# EasyEDA schematic schematics.json
TITLE: Broca; REV: A; Date: 2024-07-22; Sheet: 1/1; Drawn By: Arthur LAURENT; Company: Mental Noise
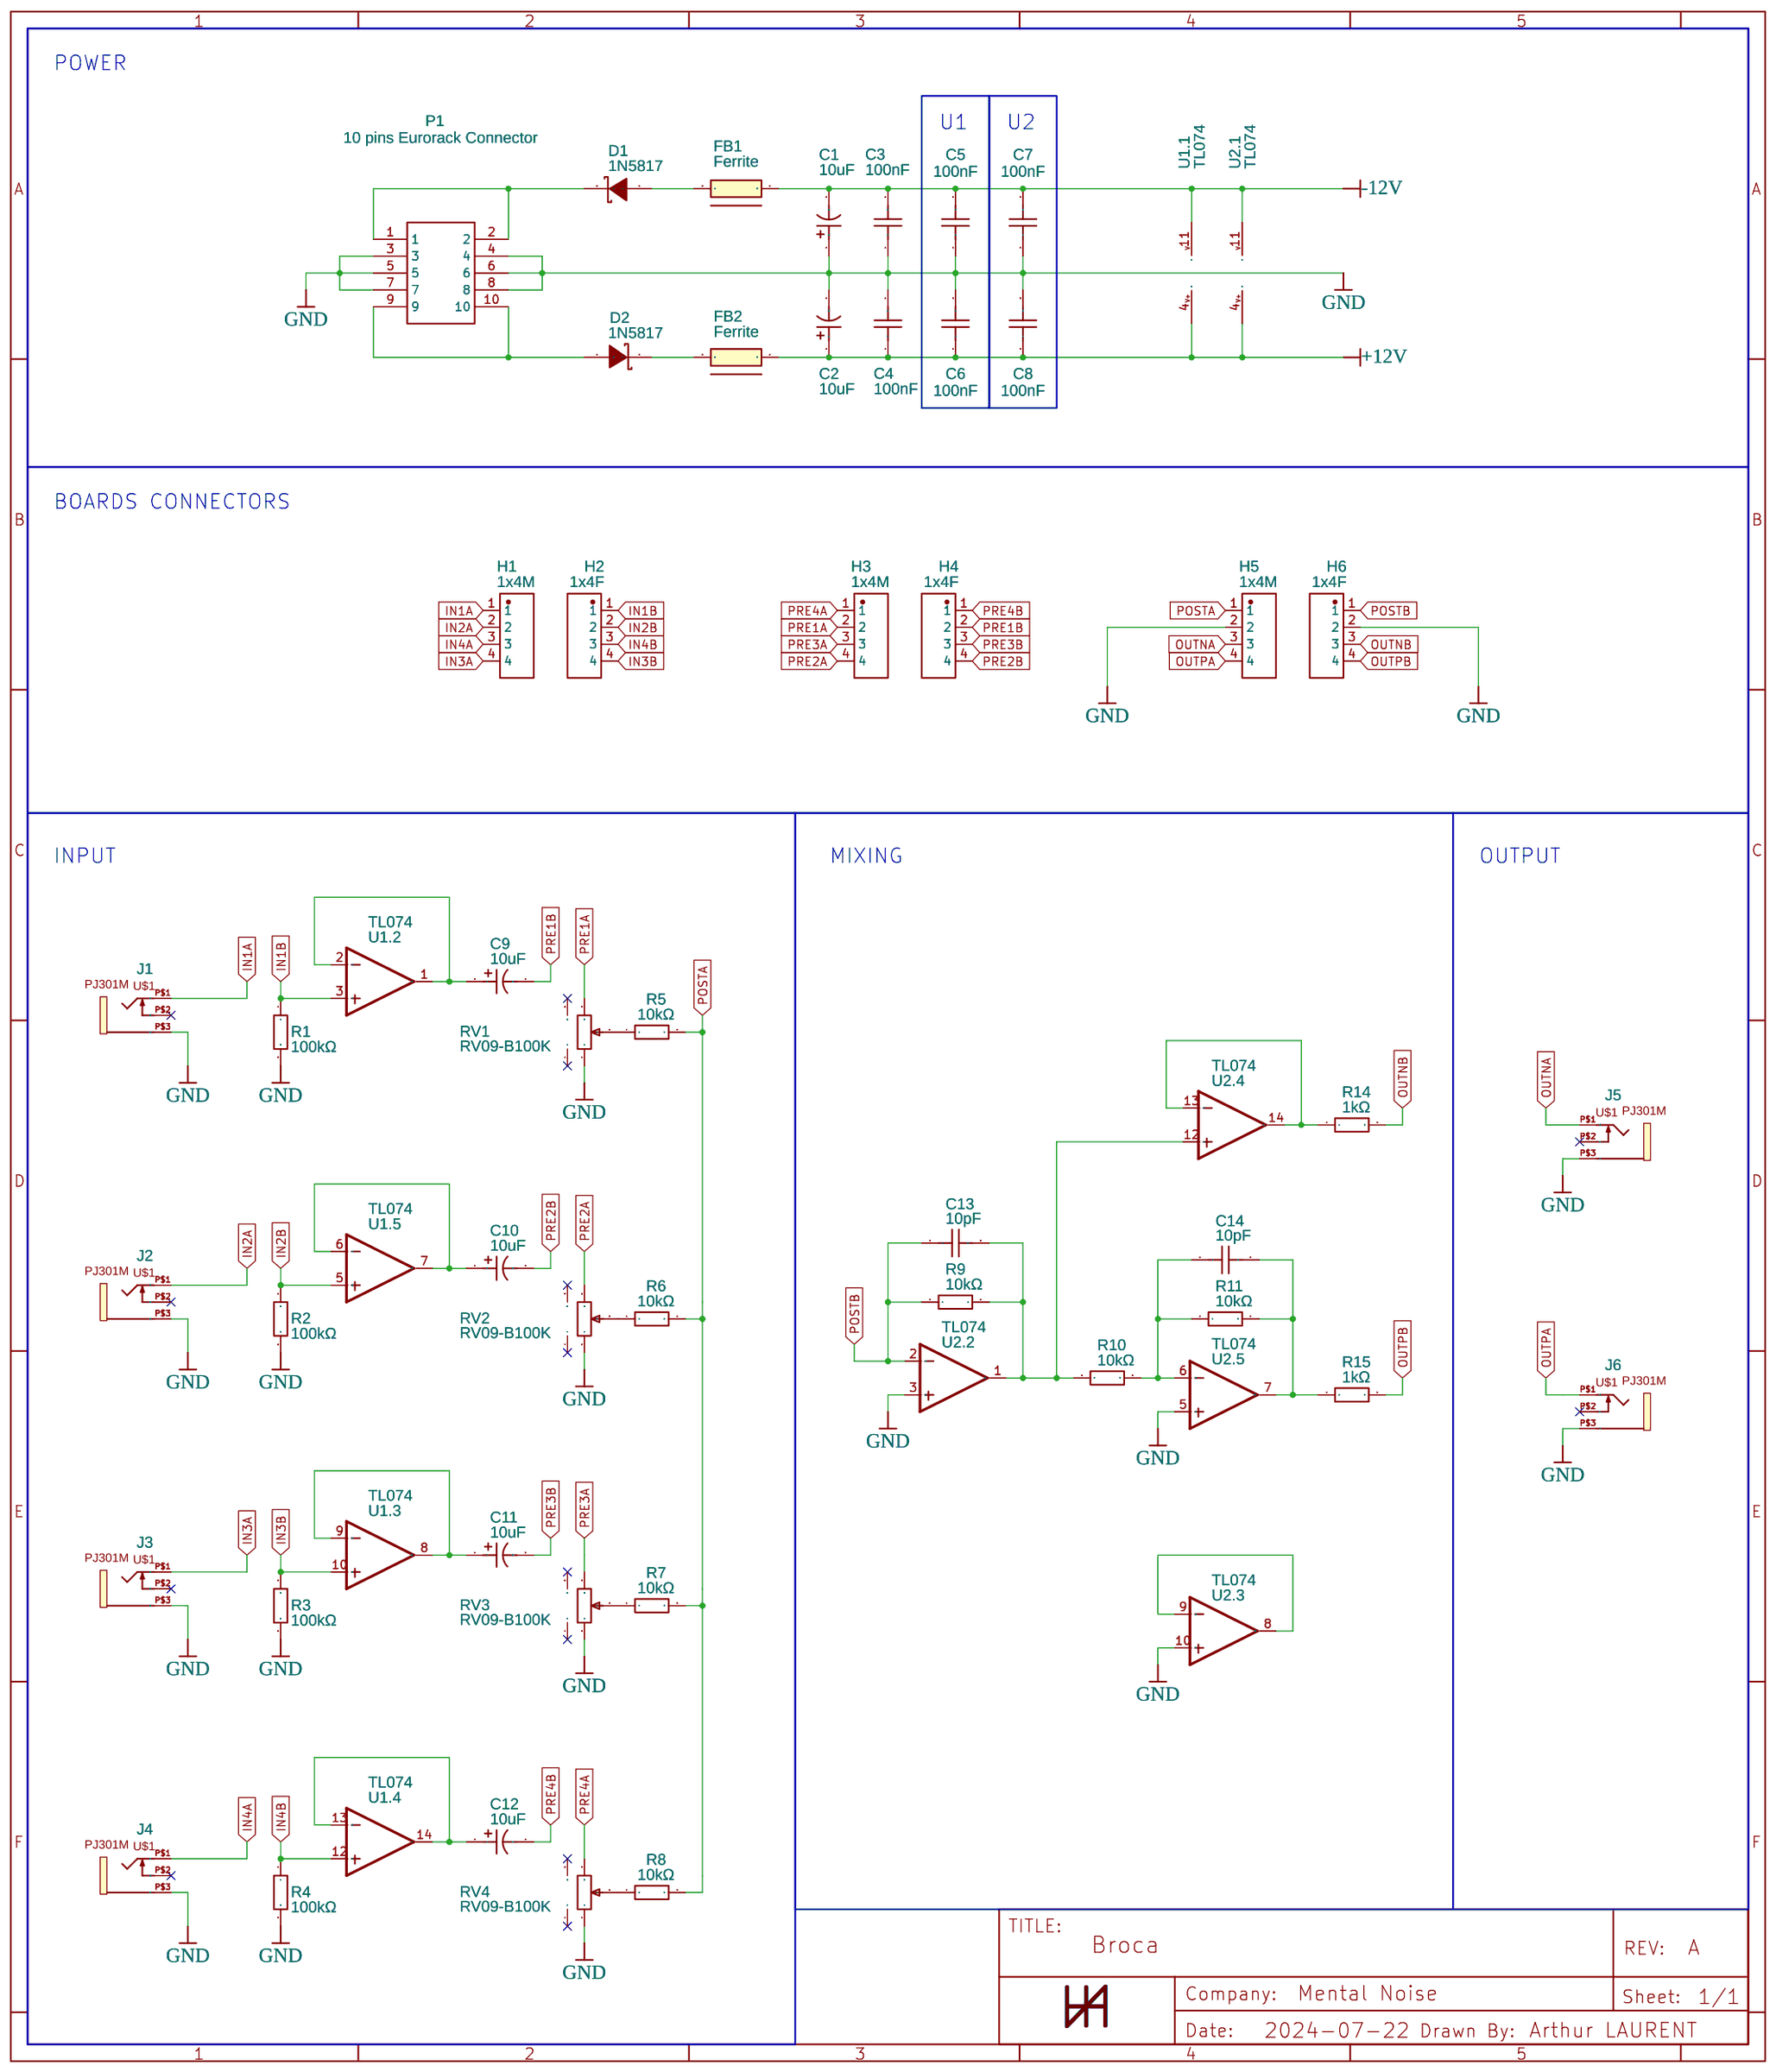
[diagram p0: schematic sheet]

## Parts
C1  10uF  [CAP-TH_BD5.0-P2.0-D0.5]
C2  10uF  [CAP-TH_BD5.0-P2.0-D0.5]
C3  100nF  [CAP-TH_L3.8-W2.5-P2.54-D0.50]
C4  100nF  [CAP-TH_L3.8-W2.5-P2.54-D0.50]
C5  100nF  [CAP-TH_L3.8-W2.5-P2.54-D0.50]
C6  100nF  [CAP-TH_L3.8-W2.5-P2.54-D0.50]
C7  100nF  [CAP-TH_L3.8-W2.5-P2.54-D0.50]
C8  100nF  [CAP-TH_L3.8-W2.5-P2.54-D0.50]
C9  10uF  [CAP-TH_BD6.3-P2.5-D0.5]
C10  10uF  [CAP-TH_BD6.3-P2.5-D0.5]
C11  10uF  [CAP-TH_BD6.3-P2.5-D0.5]
C12  10uF  [CAP-TH_BD6.3-P2.5-D0.5]
C13  10pF  [CAP-TH_L3.8-W2.5-P2.54-D0.50]
C14  10pF  [CAP-TH_L3.8-W2.5-P2.54-D0.50]
D1  1N5817  [DO-41_BD2.4-L4.7-P8.70-D0.9-FD]
D2  1N5817  [DO-41_BD2.4-L4.7-P8.70-D0.9-FD]
FB1  Ferrite  [FERRITE BEAD VERT]
FB2  Ferrite  [FERRITE BEAD VERT]
H1  1x4M  [HDR-TH_4P-P2.54-V-M-A]
H2  1x4F  [HDR-TH_4P-P2.54-V-M-A]
H3  1x4M  [HDR-TH_4P-P2.54-V-M-A]
H4  1x4F  [HDR-TH_4P-P2.54-V-M-A]
H5  1x4M  [HDR-TH_4P-P2.54-V-M-A]
H6  1x4F  [HDR-TH_4P-P2.54-V-M-A]
J1  PJ301M  [PJ301M_NOGND]
J2  PJ301M  [PJ301M_NOGND]
J3  PJ301M  [PJ301M]
J4  PJ301M  [PJ301M]
J5  PJ301M  [PJ301M]
J6  PJ301M  [PJ301M]
P1  10 pins Eurorack Connector  [IDC-TH_10P-P2.54-V-R2-C5-S2.54]
R1  100kΩ  [R-AXIAL-0.3]
R2  100kΩ  [R-AXIAL-0.3]
R3  100kΩ  [R-AXIAL-0.3]
R4  100kΩ  [R-AXIAL-0.3]
R5  10kΩ  [R-AXIAL-0.3]
R6  10kΩ  [R-AXIAL-0.3]
R7  10kΩ  [R-AXIAL-0.3]
R8  10kΩ  [R-AXIAL-0.3]
R9  10kΩ  [R-AXIAL-0.3]
R10  10kΩ  [R-AXIAL-0.3]
R11  10kΩ  [R-AXIAL-0.3]
R14  1kΩ  [R-AXIAL-0.3]
R15  1kΩ  [R-AXIAL-0.3]
RV1  RV09-B100K  [RES-ADJ-TH_RV09]
RV2  RV09-B100K  [RES-ADJ-TH_RV09]
RV3  RV09-B100K  [RES-ADJ-TH_RV09]
RV4  RV09-B100K  [RES-ADJ-TH_RV09]
U1  TL074  [DIP-14_L19.6-W6.4-P2.54-LS7.6-BL]  (sections 1,2,3,4,5)
U2  TL074  [DIP-14_L19.6-W6.4-P2.54-LS7.6-BL]  (sections 1,2,3,4,5)

## Library data of the parts
C1 C2 C9-C12 = CD1101061HM0511VFL: Supplier: LCSC; Supplier Part: C7493876; Manufacturer: HRK(鸿瑞凯电子); Contributor: lcsc; JLCPCB Part Class: Extended Part
C3-C8 = CL05B104KB54PNC: Contributor: LCSC; Supplier: LCSC; Supplier Part: C307331; Manufacturer: SAMSUNG(三星); JLCPCB Part Class: Basic Part
C13 C14 = CL05C100JB5NNNC: Supplier: LCSC; Manufacturer: SAMSUNG(三星); Supplier Part: C32949; JLCPCB Part Class: Basic Part
D1 D2 = 1N5817: Supplier: LCSC; Manufacturer: MDD; image: //image.lceda.cn/szlcsc/C3062.jpg; Supplier Part: C3062
FB1 FB2 = C64 FERRITE Single: Contributor: TomPilot
H1-H6 = 5-146276-4: Contributor: lcsc; Supplier: LCSC; Supplier Part: C3332208; Manufacturer: TE Connectivity(泰科电子); JLCPCB Part Class: Extended Part
J1-J6 = PJ301M: Manufacturer: thonk; link: https://www.thonk.co.uk/shop/thonkiconn/; Contributor: Christian Bloch
P1 = CONN ISP 10P: Supplier: LCSC; Manufacturer: SAMTEC; Manufacturer Part: TST-105-02-G-D; Contributor: LCSC; Supplier Part: C131327
R1-R4 = 0402WGF1003TCE: Supplier: LCSC; Manufacturer: UNI-ROYAL(厚声); Supplier Part: C25741; JLCPCB Part Class: Basic Part
R5-R8 = MFR0W4F2200A50: Supplier: LCSC; Manufacturer: UniOhm; Supplier Part: C57439
R9-R11 R14 R15 = 0402WGF1002TCE: Supplier: LCSC; Manufacturer: UNI-ROYAL(厚声); Supplier Part: C25744; JLCPCB Part Class: Basic Part
RV1-RV4 = RV09AF-40-15K-B10K: Contributor: lcsc; Supplier: LCSC; Supplier Part: C5151445; Manufacturer: null
U1 U2 = TL074: Contributor: djlace; subpart_no: 1

## Nets
+12V: C2.1 C4.1 C6.1 C8.1 FB2.1(2) U1.4(V+) U2.4(V+)
-12V: C1.2 C3.2 C5.2 C7.2 FB1.1(2) U1.11(V-) U2.11(V-)
GND: C1.1 C2.2 C3.1 C4.2 C5.1 C6.2 C7.1 C8.2 H5.2 H6.2 J1.P$3(1) J2.P$3(1) J3.P$3(1) J4.P$3(1) J5.P$3(1) J6.P$3(1) P1.3 P1.4 P1.5 P1.6 P1.7 P1.8 R1.2 R2.2 R3.2 R4.2 RV1.1 RV2.1 RV3.1 RV4.1 U2.3(+IN) U2.5(+IN) U2.10(+IN)
IN1A: H1.1 J1.P$1(2)
IN1B: H2.1 R1.1 U1.3(+IN)
IN2A: H1.2 J2.P$1(2)
IN2B: H2.2 R2.1 U1.5(+IN)
IN3A: H1.4 J3.P$1(2)
IN3B: H2.4 R3.1 U1.10(+IN)
IN4A: H1.3 J4.P$1(2)
IN4B: H2.3 R4.1 U1.12(+IN)
OUTNA: H5.3 J5.P$1(2)
OUTNB: H6.3 R14.2
OUTPA: H5.4 J6.P$1(2)
OUTPB: H6.4 R15.2
POSTA: H5.1 R5.2 R6.2 R7.2 R8.2
POSTB: C13.1 H6.1 R9.1 U2.2(-IN)
PRE1A: H3.2 RV1.3
PRE1B: C9.2 H4.2
PRE2A: H3.4 RV2.3
PRE2B: C10.2 H4.4
PRE3A: H3.3 RV3.3
PRE3B: C11.2 H4.3
PRE4A: H3.1 RV4.3
PRE4B: C12.2 H4.1
Net-(C9-1): C9.1 U1.1(OUT) U1.2(-IN)
Net-(C10-1): C10.1 U1.6(-IN) U1.7(OUT)
Net-(C11-1): C11.1 U1.8(OUT) U1.9(-IN)
Net-(C12-1): C12.1 U1.13(-IN) U1.14(OUT)
Net-(C13-2): C13.2 R9.2 R10.1 U2.1(OUT) U2.12(+IN)
Net-(C14-1): C14.1 R10.2 R11.1 U2.6(-IN)
Net-(C14-2): C14.2 R11.2 R15.1 U2.7(OUT)
Net-(D1-1): D1.1(A) FB1.2(1)
Net-(D1-2): D1.2(K) P1.1 P1.2
Net-(D2-1): D2.1(A) P1.9 P1.10
Net-(D2-2): D2.2(K) FB2.2(1)
Net-(R5-1): R5.1 RV1.2
Net-(R6-1): R6.1 RV2.2
Net-(R7-1): R7.1 RV3.2
Net-(R8-1): R8.1 RV4.2
Net-(R14-1): R14.1 U2.13(-IN) U2.14(OUT)
Net-(U2.3-8): U2.8(OUT) U2.9(-IN)

Not connected (* = marked no-connect by the designer): J1 P$2(3)*; J2 P$2(3)*; J3 P$2(3)*; J4 P$2(3)*; J5 P$2(3)*; J6 P$2(3)*; RV1 4* 5*; RV2 4* 5*; RV3 4* 5*; RV4 4* 5*

## Notes on the sheet
- POWER
- U1
- U2
- BOARDS CONNECTORS
- INPUT
- MIXING
- OUTPUT
